# Altium schematic sheet LED_Button.SchDoc
size A4; SheetNumber: 2; SheetTotal: 6
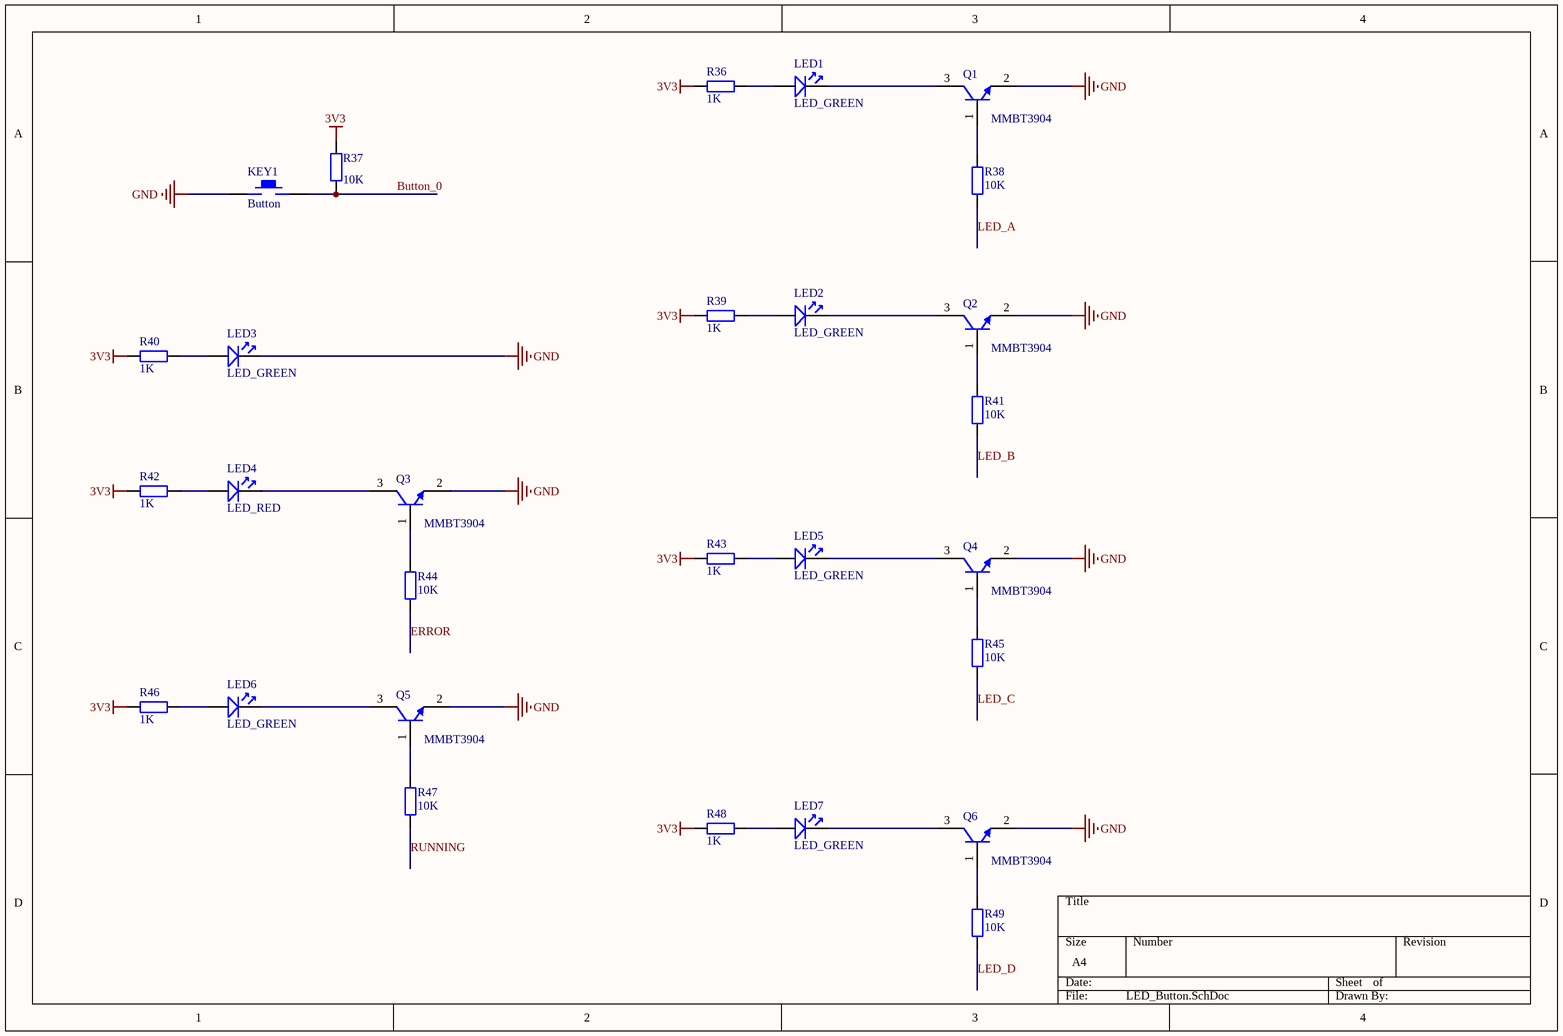
[diagram p0: LED_Button.SchDoc]

## Parts
KEY1  Button  [KEY_SOP324225]
LED1  LED_GREEN  [LED 0603R]
LED2  LED_GREEN  [LED 0603R]
LED3  LED_GREEN  [LED 0603R]
LED4  LED_RED  [LED 0603R]
LED5  LED_GREEN  [LED 0603R]
LED6  LED_GREEN  [LED 0603R]
LED7  LED_GREEN  [LED 0603R]
Q1  MMBT3904  [FAIR-SOT23-3_V]
Q2  MMBT3904  [FAIR-SOT23-3_V]
Q3  MMBT3904  [FAIR-SOT23-3_V]
Q4  MMBT3904  [FAIR-SOT23-3_V]
Q5  MMBT3904  [FAIR-SOT23-3_V]
Q6  MMBT3904  [FAIR-SOT23-3_V]
R36  1K  [R 0402_L]
R37  10K  [R 0402_L]
R38  10K  [R 0402_L]
R39  1K  [R 0402_L]
R40  1K  [R 0402_L]
R41  10K  [R 0402_L]
R42  1K  [R 0402_L]
R43  1K  [R 0402_L]
R44  10K  [R 0402_L]
R45  10K  [R 0402_L]
R46  1K  [R 0402_L]
R47  10K  [R 0402_L]
R48  1K  [R 0402_L]
R49  10K  [R 0402_L]

## Nets
3V3: R36.1 R37.2 R39.1 R40.1 R42.1 R43.1 R46.1 R48.1
GND: KEY1.1 LED3.2 Q1.2(E) Q2.2(E) Q3.2(E) Q4.2(E) Q5.2(E) Q6.2(E)
Button_0: KEY1.2 R37.1
ERROR: R44.1
LED_A: R38.1
LED_B: R41.1
LED_C: R45.1
LED_D: R49.1
RUNNING: R47.1
NetLED1_1: LED1.1 R36.2
NetLED1_2: LED1.2 Q1.3(C)
NetLED2_1: LED2.1 R39.2
NetLED2_2: LED2.2 Q2.3(C)
NetLED3_1: LED3.1 R40.2
NetLED4_1: LED4.1 R42.2
NetLED4_2: LED4.2 Q3.3(C)
NetLED5_1: LED5.1 R43.2
NetLED5_2: LED5.2 Q4.3(C)
NetLED6_1: LED6.1 R46.2
NetLED6_2: LED6.2 Q5.3(C)
NetLED7_1: LED7.1 R48.2
NetLED7_2: LED7.2 Q6.3(C)
NetQ1_1: Q1.1(B) R38.2
NetQ2_1: Q2.1(B) R41.2
NetQ3_1: Q3.1(B) R44.2
NetQ4_1: Q4.1(B) R45.2
NetQ5_1: Q5.1(B) R47.2
NetQ6_1: Q6.1(B) R49.2

## Library data of the parts
KEY1 = KEY_M
LED1-LED7 = LED
Q1-Q6 = CMP-1670-00008-1: NPN General Purpose Amplifier, 40 V, 0.2 A, -55 to 150 degC, 3-Pin SOT23, RoHS, Tape and Reel; Tolerance: 30ppm; Capacitance: 1.8E-11 f; Frequency: 12.288 MHz; ESR: 40 Ohm; Load Capacitance: 18 pF; REACH SVHC: No SVHC; Pins: 4; ComponentLink3URL: http://www.fairchildsemi.com/dwg/MA/MA03D.pdf; PackageDescription: 3-Pin Small Outline Transistor, Body 2.92 x 1.325 mm, Pitch 0.95 mm; ComponentLink1URL: https://www.fairchildsemi.com/; Max Operating Temperature: 70degC; PackageReference: SOT23-3; ComponentLink1Description: Manufacturer URL; Width: 0.126 inch; Min Operating Temperature: -20degC; DatasheetVersion: Rev. 1.1.0, 10/2014; Mount: Surface Mount; Height: 0.041 inch; Package Quantity: 1000; Frequency Tolerance: 30ppm; Packaging: Tape and Reel; ComponentLink2URL: https://www.fairchildsemi.com/datasheets/MM/MMBT3904.pdf; RoHSCompliant: True; ComponentLink3Description: Package Specification; ComponentLink2Description: Datasheet; Length: 0.197 inch
R36-R49 = R_1: 贴片电阻; 版权归属: 源创客; BOM名称: 贴片电阻; 学习资源: www.ooocke.com